# Altium schematic sheet advsensor_vertical.SchDoc
size A4
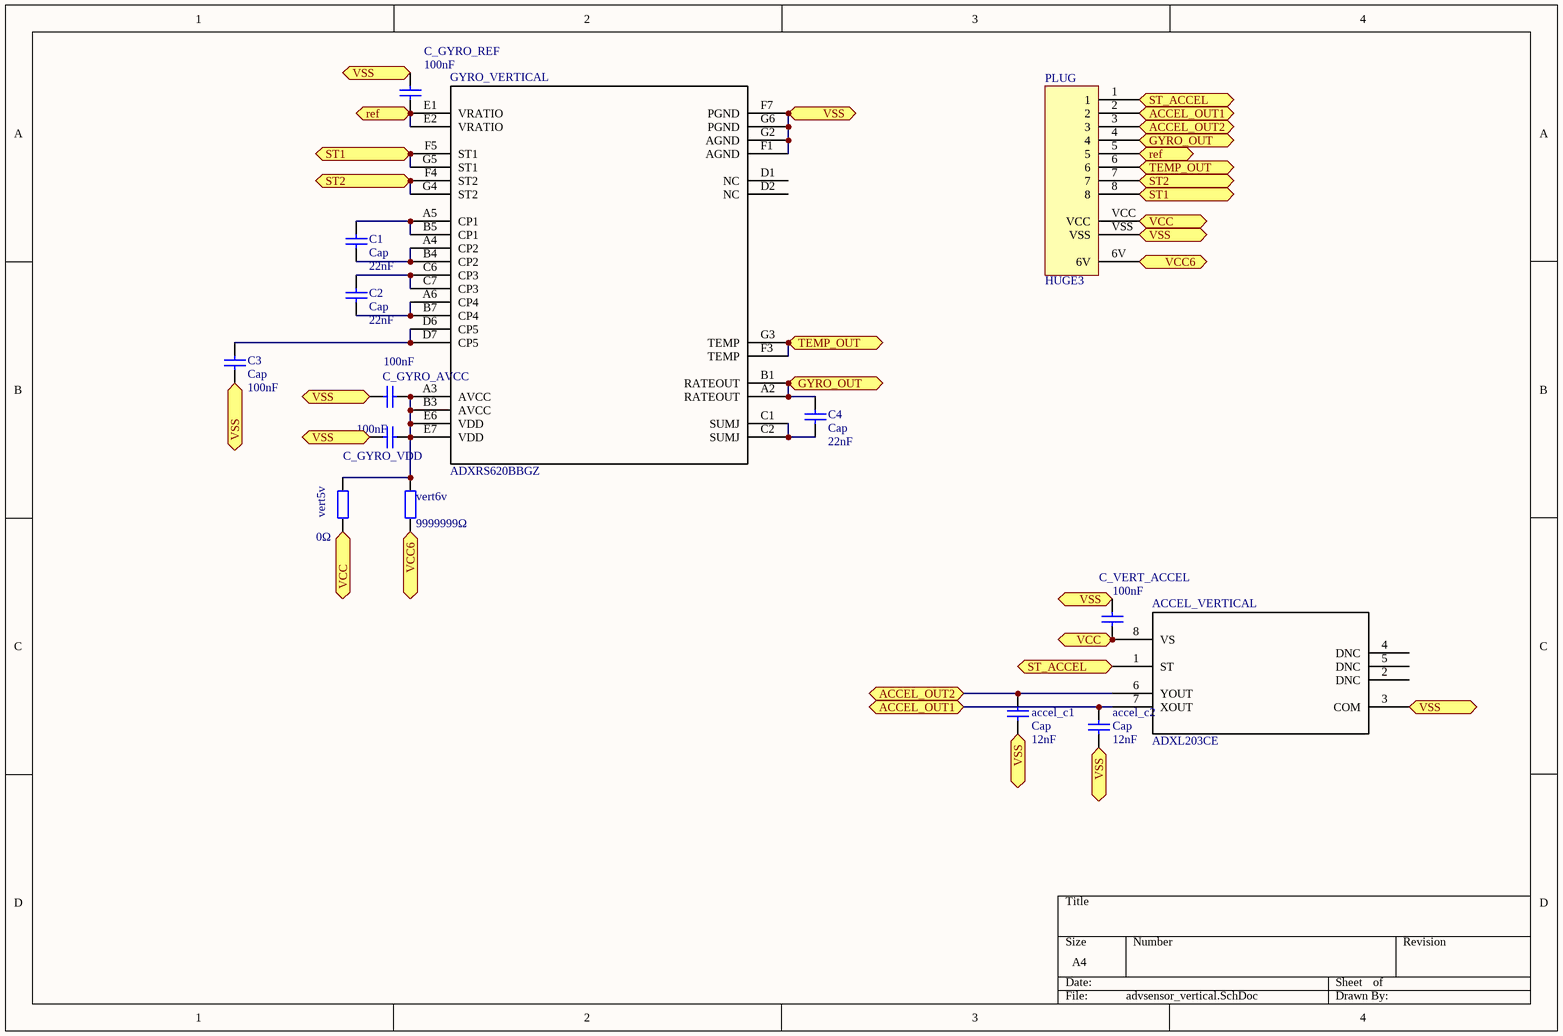
[diagram p0: advsensor_vertical.SchDoc]

## Parts
accel_c1  Cap  value 12nF  [0805]
accel_c2  Cap  value 12nF  [0805]
ACCEL_VERTICAL  ADXL203CE  [ADXL203]
C1  Cap  value 22nF  [0805]
C2  Cap  value 22nF  [0805]
C3  Cap  value 100nF  [0805]
C4  Cap  value 22nF  [0805]
C_GYRO_AVCC  value 100nF  [0805]
C_GYRO_REF  value 100nF  [0805]
C_GYRO_VDD  value 100nF  [0805]
C_VERT_ACCEL  value 100nF  [0805]
GYRO_VERTICAL  ADXRS620BBGZ  [BG_32_3]
PLUG  HUGE3  [BIG]
vert5v  value 0Ω  [0603 - no]
vert6v  value 9999999Ω  [0603 - no]

## Ports
ACCEL_OUT1, ACCEL_OUT2, GYRO_OUT, ref, ST1, ST2, ST_ACCEL, TEMP_OUT, VCC, VCC6, VSS

## Nets
ACCEL_OUT1: accel_c2.2 ACCEL_VERTICAL.7(XOUT) PLUG.2 ; port ACCEL_OUT1
ACCEL_OUT2: accel_c1.2 ACCEL_VERTICAL.6(YOUT) PLUG.3 ; port ACCEL_OUT2
GYRO_OUT: C4.2 GYRO_VERTICAL.A2(RATEOUT) GYRO_VERTICAL.B1(RATEOUT) PLUG.4 ; port GYRO_OUT
ref: C_GYRO_REF.1 GYRO_VERTICAL.E1(VRATIO) GYRO_VERTICAL.E2(VRATIO) PLUG.5 ; port ref
ST1: GYRO_VERTICAL.F5(ST1) GYRO_VERTICAL.G5(ST1) PLUG.8 ; port ST1
ST2: GYRO_VERTICAL.F4(ST2) GYRO_VERTICAL.G4(ST2) PLUG.7 ; port ST2
ST_ACCEL: ACCEL_VERTICAL.1(ST) PLUG.1 ; port ST_ACCEL
TEMP_OUT: GYRO_VERTICAL.F3(TEMP) GYRO_VERTICAL.G3(TEMP) PLUG.6 ; port TEMP_OUT
VCC: ACCEL_VERTICAL.8(VS) C_VERT_ACCEL.1 PLUG.VCC vert5v.1 ; port VCC
VCC6: PLUG.6V vert6v.2 ; port VCC6
VSS: accel_c1.1 accel_c2.1 ACCEL_VERTICAL.3(COM) C3.1 C_GYRO_AVCC.2 C_GYRO_REF.2 C_GYRO_VDD.2 C_VERT_ACCEL.2 GYRO_VERTICAL.F1(AGND) GYRO_VERTICAL.F7(PGND) GYRO_VERTICAL.G2(AGND) GYRO_VERTICAL.G6(PGND) PLUG.VSS ; port VSS
NetC1_1: C1.1 GYRO_VERTICAL.A4(CP2) GYRO_VERTICAL.B4(CP2)
NetC1_2: C1.2 GYRO_VERTICAL.A5(CP1) GYRO_VERTICAL.B5(CP1)
NetC2_1: C2.1 GYRO_VERTICAL.A6(CP4) GYRO_VERTICAL.B7(CP4)
NetC2_2: C2.2 GYRO_VERTICAL.C6(CP3) GYRO_VERTICAL.C7(CP3)
NetC3_2: C3.2 GYRO_VERTICAL.D6(CP5) GYRO_VERTICAL.D7(CP5)
NetC4_1: C4.1 GYRO_VERTICAL.C1(SUMJ) GYRO_VERTICAL.C2(SUMJ)
NetC_GYRO_AVCC_1: C_GYRO_AVCC.1 C_GYRO_VDD.1 GYRO_VERTICAL.A3(AVCC) GYRO_VERTICAL.B3(AVCC) GYRO_VERTICAL.E6(VDD) GYRO_VERTICAL.E7(VDD) vert5v.2 vert6v.1

Not connected (* = marked no-connect by the designer): ACCEL_VERTICAL 2(DNC) 4(DNC) 5(DNC); GYRO_VERTICAL D1(NC) D2(NC)

## Library data of the parts
accel_c1 accel_c2 C1-C4 C_GYRO_AVCC C_GYRO_REF C_GYRO_VDD C_VERT_ACCEL = Cap: Capacitor; Published: 8-Jun-2000; LatestRevisionDate: 17-Jul-2002; LatestRevisionNote: Re-released for DXP Platform.; PackageReference: RAD-0.3; Publisher: Altium Limited; PackageDescription: Radial Cap, Thru-Hole; 2 Leads; 0.3 in Pin Spacing
ACCEL_VERTICAL = ADXL203CE: Imported; RefDes: RefDes; Type: DEV; Value: Value
GYRO_VERTICAL = ADXRS620BBGZ: Imported; Manufacturer_Part_Number: ADXRS613BBGZ; Vendor: Vendor; RefDes: RefDes; Type: DEV; Value: Value
vert5v vert6v = Res2: Resistor; Published: 8-Jun-2000; LatestRevisionDate: 17-Jul-2002; LatestRevisionNote: Re-released for DXP Platform.; PackageReference: AXIAL-0.4; Publisher: Altium Limited; PackageDescription: Axial Device, Thru-Hole; 2 Leads; 0.4 in Pin Spacing